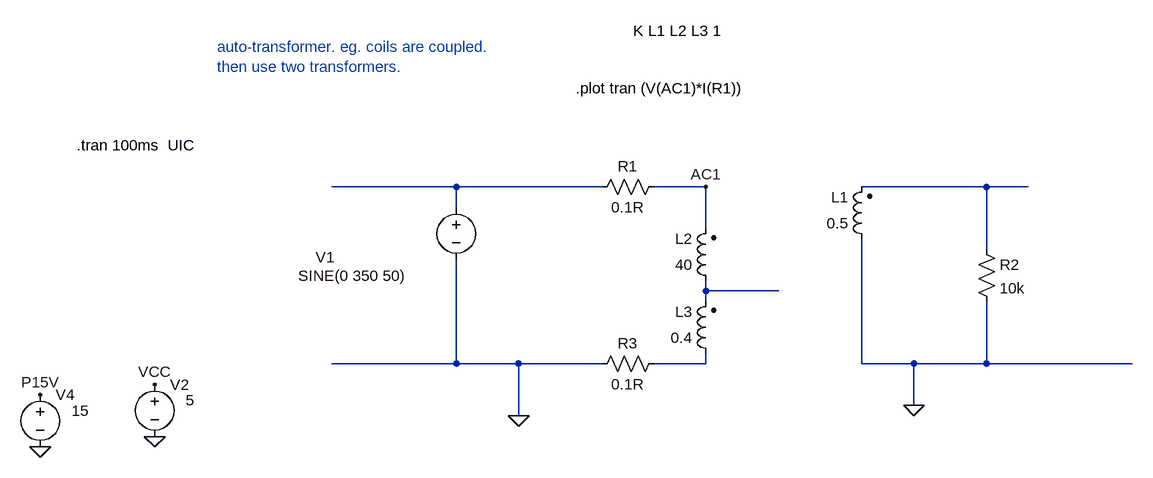
[diagram p0: schematic Draft05.asc]
Draft05.asc, the LTspice schematic file:
Version 4
SHEET 1 5720 1740
WIRE 416 -160 224 -160
WIRE 640 -160 416 -160
WIRE 800 -160 720 -160
WIRE 1232 -160 1040 -160
WIRE 1296 -160 1232 -160
WIRE 416 -128 416 -160
WIRE 800 -96 800 -160
WIRE 1232 -64 1232 -160
WIRE 800 0 800 -16
WIRE 912 0 800 0
WIRE 800 16 800 0
WIRE 416 112 416 -48
WIRE 416 112 224 112
WIRE 512 112 416 112
WIRE 640 112 512 112
WIRE 800 112 800 96
WIRE 800 112 720 112
WIRE 1040 112 1040 -80
WIRE 1120 112 1040 112
WIRE 1232 112 1232 16
WIRE 1232 112 1120 112
WIRE 1456 112 1232 112
WIRE 1120 176 1120 112
WIRE 512 192 512 112
FLAG -48 224 0
FLAG -48 144 VCC
FLAG -224 240 0
FLAG -224 160 P15V
FLAG 512 192 0
FLAG 800 -160 AC1
FLAG 1120 176 0
SYMBOL voltage -48 128 R0
WINDOW 123 0 0 Left 0
WINDOW 39 0 0 Left 0
WINDOW 3 48 40 Left 2
SYMATTR Value 5
SYMATTR InstName V2
SYMBOL voltage -224 144 R0
WINDOW 123 0 0 Left 0
WINDOW 39 0 0 Left 0
WINDOW 3 48 40 Left 2
SYMATTR Value 15
SYMATTR InstName V4
SYMBOL ind2 816 0 R180
WINDOW 0 36 80 Left 2
WINDOW 3 36 40 Left 2
SYMATTR InstName L2
SYMATTR Value 40
SYMATTR Type ind
SYMBOL voltage 416 -144 R0
WINDOW 123 0 0 Left 0
WINDOW 39 0 0 Left 0
WINDOW 3 -243 121 Left 2
WINDOW 0 -216 92 Left 2
SYMATTR Value SINE(0 350 50)
SYMATTR InstName V1
SYMBOL res 736 -176 R90
WINDOW 0 0 56 VBottom 2
WINDOW 3 32 56 VTop 2
SYMATTR InstName R1
SYMATTR Value 0.1R
SYMBOL res 736 96 R90
WINDOW 0 0 56 VBottom 2
WINDOW 3 32 56 VTop 2
SYMATTR InstName R3
SYMATTR Value 0.1R
SYMBOL ind2 1056 -64 R180
WINDOW 0 36 80 Left 2
WINDOW 3 36 40 Left 2
SYMATTR InstName L1
SYMATTR Value 0.5
SYMATTR Type ind
SYMBOL res 1216 -80 R0
SYMATTR InstName R2
SYMATTR Value 10k
SYMBOL ind2 816 112 R180
WINDOW 0 36 80 Left 2
WINDOW 3 36 40 Left 2
SYMATTR InstName L3
SYMATTR Value 0.4
SYMATTR Type ind
TEXT -168 -224 Left 2 !.tran 100ms  UIC
TEXT 600 -312 Left 2 !.plot tran (V(AC1)*I(R1))
TEXT 688 -400 Left 2 !K L1 L2 L3 1
TEXT 48 -376 Left 2 ;auto-transformer. eg. coils are coupled.\nthen use two transformers.

The netlist it stands for:
* Draft05.asc
V2 VCC 0 5
V4 P15V 0 15
L2 N003 AC1 40
V1 N001 0 SINE(0 350 50)
R1 AC1 N001 0.1R
R3 N004 0 0.1R
L1 0 N002 0.5
R2 N002 0 10k
L3 N004 N003 0.4
.tran 100ms  UIC
.plot tran (V(AC1)*I(R1))
K L1 L2 L3 1
* auto-transformer. eg. coils are coupled.
* then use two transformers.
.backanno
.end